# Altium project ИТКС.685623.177.PrjPcb
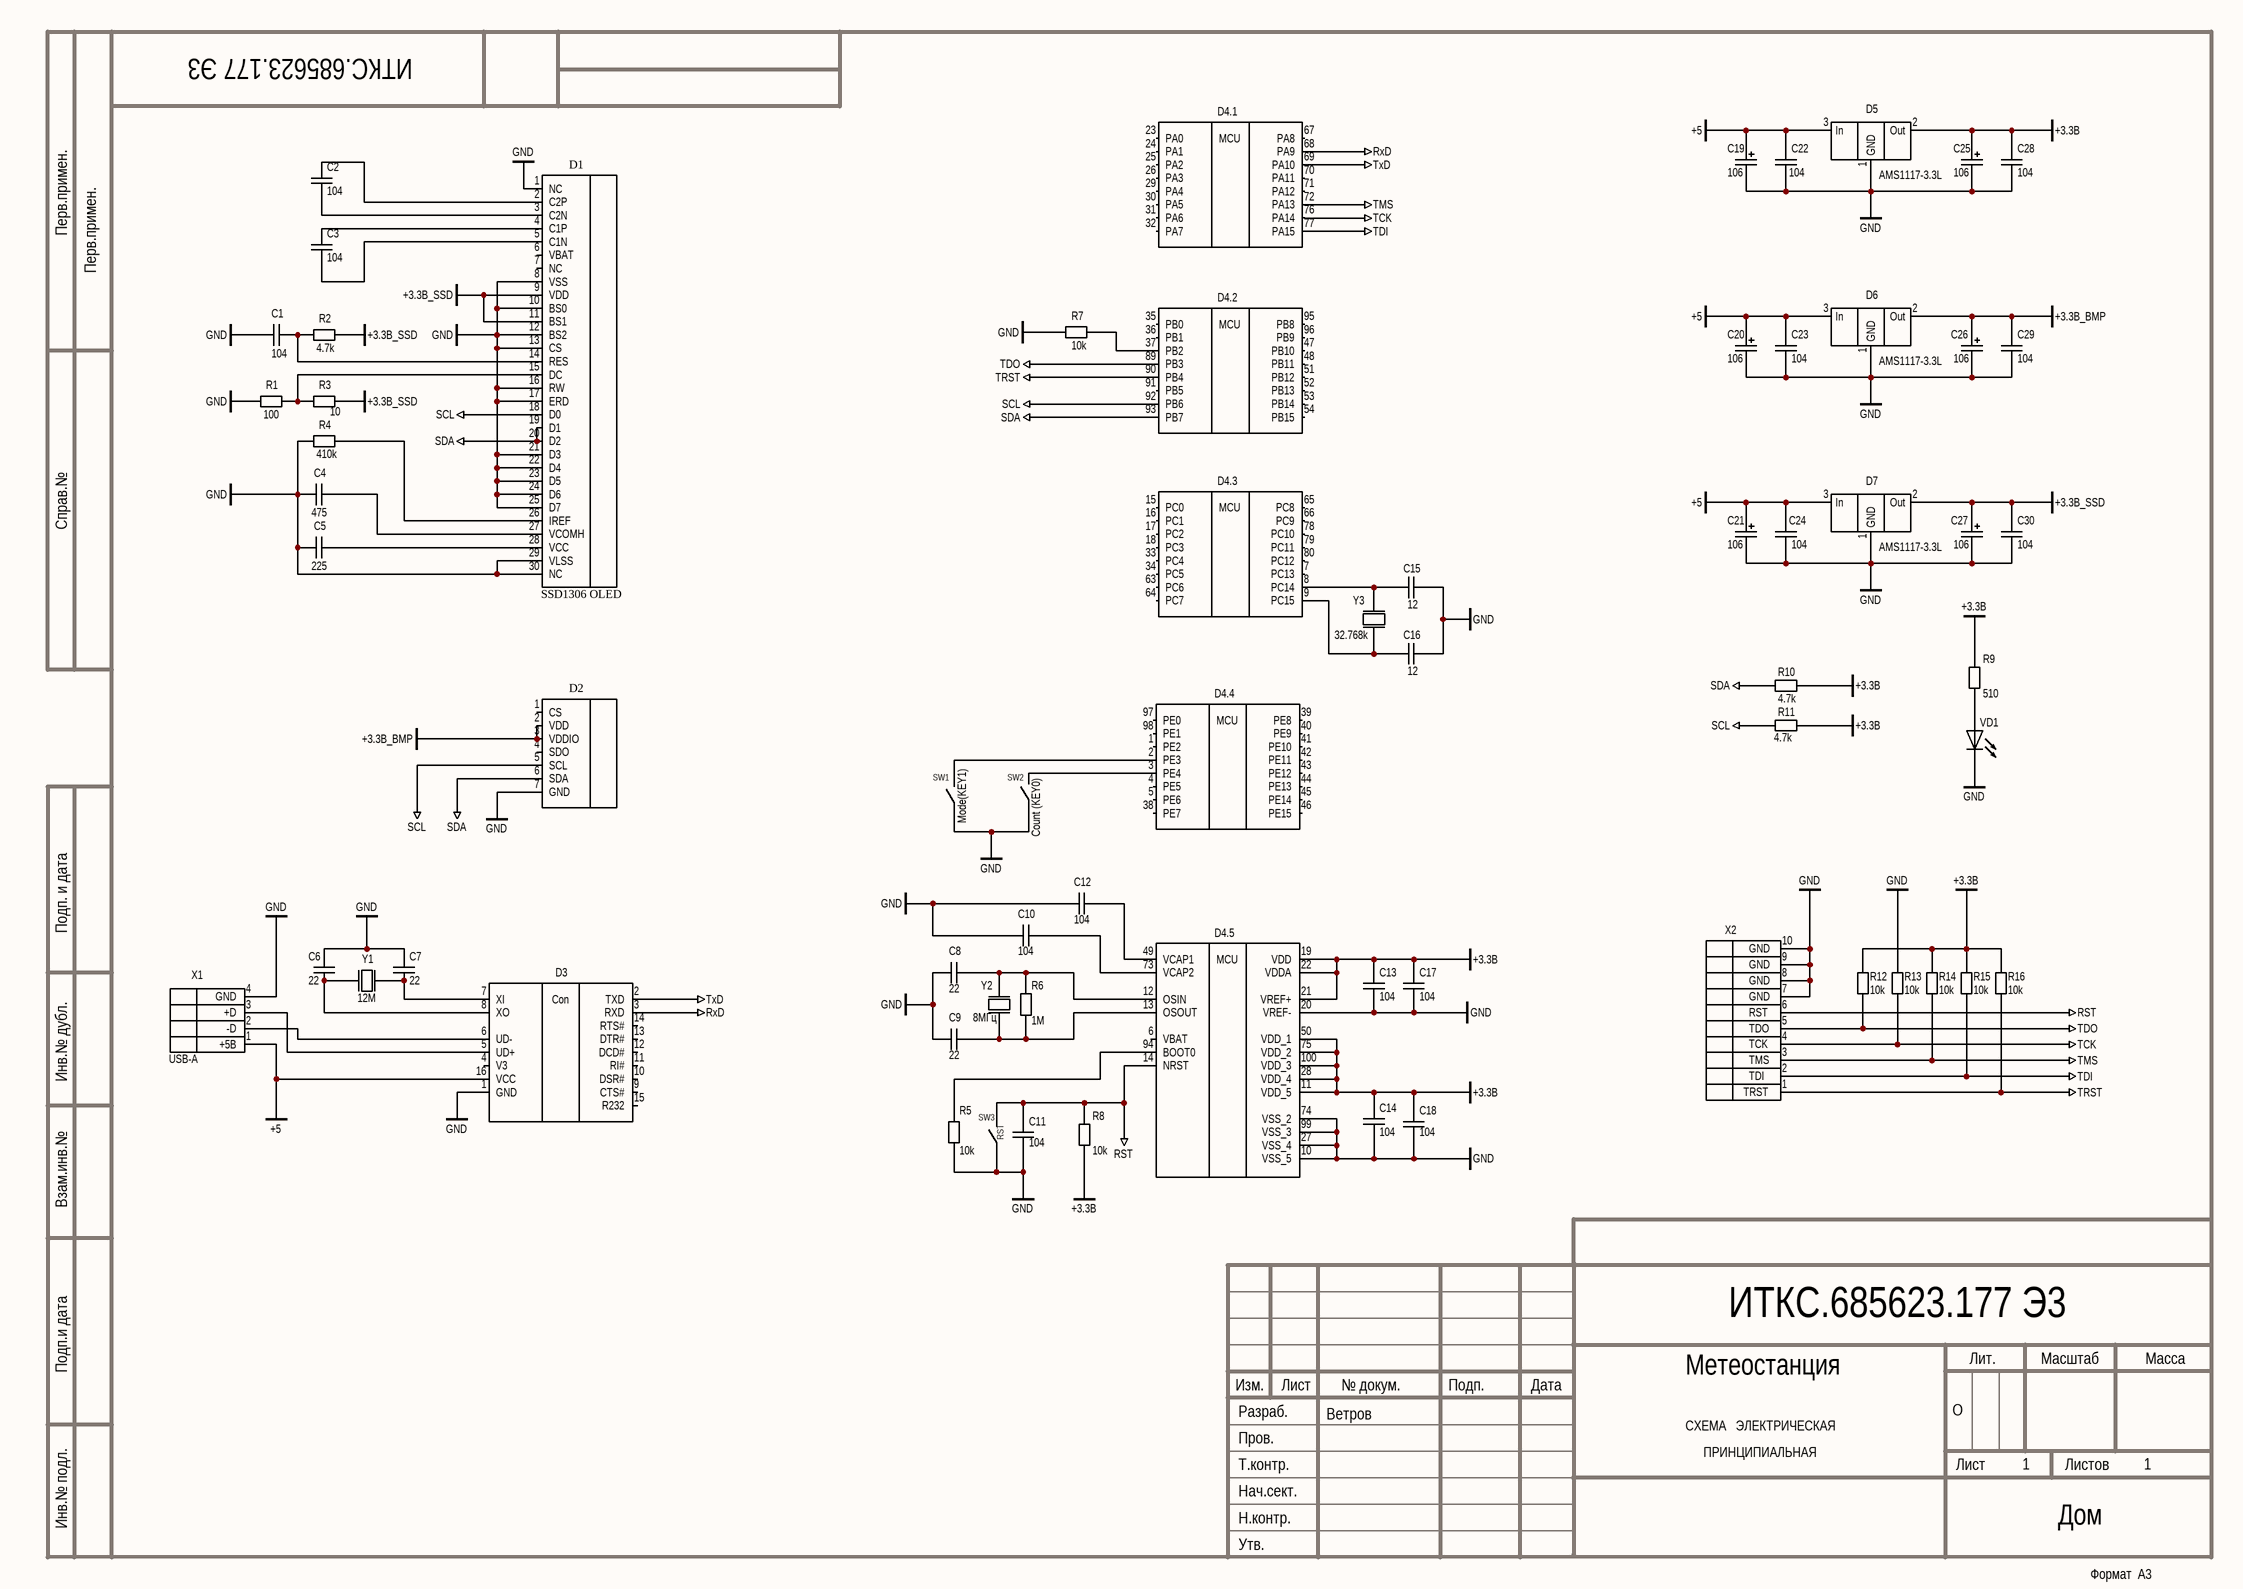
[diagram p0: ИТКС.685623.177 Э3.SchDoc]
1 sheet, 62 parts. Net scope: global (net labels, ports and power ports of the same name join across sheets).
Board file: ИТКС.177623.PcbDoc

## Sheet ИТКС.685623.177 Э3.SchDoc
size 420 x 297 mm; Author: Ветров; CompanyName: Дом; SheetNumber: 1; SheetTotal: 1; PageSetup: Record=PageOptions|CenterHorizontal=True|CenterVertical=True|PrintScale=0.94|XCorrection=1.00|YCorrection=1.00|PrintKind=1|BorderSize=5000000|LeftOffset=0|BottomOffset=0|Orientation=1|PaperLength=1000|PaperWidth=1000|Scale=100|PaperSource=7|PrintQuality=-4|MediaType=1|DitherType=10|PaperKind=A4|PrintScaleMode=1; DecimalNumber: ИТКС.685623.177 Э3; MainDevice: Перв.примен.; Name1: Метеостанция; lit_A: О; Name: Наименование

### Parts
C1  104  [0603]
C2  104  [0603]
C3  104  [0603]
C4  475  [0603]
C5  225  [0603]
C6  22  [0603]
C7  22  [0603]
C8  22  [0603]
C9  22  [0603]
C10  104  [0603]
C11  104  [0603]
C12  104  [0603]
C13  104  [0603]
C14  104  [0603]
C15  12  [0603]
C16  12  [0603]
C17  104  [0603]
C18  104  [0603]
C19  106  [EIA_6032–28]
C20  106  [EIA_6032–28]
C21  106  [EIA_6032–28]
C22  104  [0603]
C23  104  [0603]
C24  104  [0603]
C25  106  [EIA_6032–28]
C26  106  [EIA_6032–28]
C27  106  [EIA_6032–28]
C28  104  [0603]
C29  104  [0603]
C30  104  [0603]
D1  SSD1306 OLED  [SSD1306]
D2  BMP180  [BMP180]  (value not drawn)
D3  CH340G  [SOP16]  (value not drawn)
D4  STM32F407VE  [LQFP100]  (value not drawn)  (parts A,B,C,E,F of 6)
D5  AMS1117-3.3L  [SOT223-4N]
D6  AMS1117-3.3L  [SOT223-4N]
D7  AMS1117-3.3L  [SOT223-4N]
R1  100  [0603]
R2  4.7k  [0603]
R3  10  [0603]
R4  410k  [0603]
R5  10k  [0603]
R6  1M  [0603]
R7  10k  [0603]
R8  10k  [0603]
R9  510  [0603]
R10  4.7k  [0603]
R11  4.7k  [0603]
R12  10k  [0603]
R13  10k  [0603]
R14  10k  [0603]
R15  10k  [0603]
R16  10k  [0603]
SW1  Mode(KEY1)  [0603]
SW2  Count (KEY0)  [0603]
SW3  RST  [0603]
VD1  LED SMD 0805  [Led Diode 0805]  (value not drawn)
X1  USB-A  [USB-ASM (DS1098-B)]
X2  PLC-10  [PLC-10]  (value not drawn)
Y1  12M  [HC-49SM]
Y2  8МГц  [HC-49SM]
Y3  32.768k  [HC-49SM]

### Nets
+3.3В: C13.1 C14.1 C17.1 C18.1 C25.1 C28.2 D4.11(VDD_5) D4.19(VDD) D4.21(VREF+) D4.22(VDDA) D4.28(VDD_4) D4.50(VDD_1) D4.75(VDD_2) D4.100(VDD_3) D5.2(Out) R8.2 R9.1 R10.2 R11.2 R12.2 R14.2 R15.2 R16.2
+3.3В_BMP: C26.1 C29.2 D2.2(VDD) D2.3(VDDIO) D6.2(Out)
+3.3В_SSD: C27.1 C30.2 D1.9(VDD) D1.11(BS1) D7.2(Out) R2.1 R3.1
+5: C19.1 C20.1 C21.1 C22.2 C23.2 C24.2 D3.16(VCC) D5.3(In) D6.3(In) D7.3(In) X1.1(+5В)
GND: C1.1 C4.1 C5.1 C6.2 C7.2 C8.2 C9.2 C10.2 C11.1 C12.2 C13.2 C14.2 C15.1 C16.1 C17.2 C18.2 C19.2 C20.2 C21.2 C22.1 C23.1 C24.1 C25.2 C26.2 C27.2 C28.1 C29.1 C30.1 D1.1(NC) D1.8(VSS) D1.10(BS0) D1.12(BS2) D1.13(CS) D1.16(RW) D1.17(ERD) D1.21(D3) D1.22(D4) D1.23(D5) D1.24(D6) D1.25(D7) D1.29(VLSS) D1.30(NC) D2.7(GND) D3.1(GND) D4.10(VSS_5) D4.20(VREF-) D4.27(VSS_4) D4.74(VSS_2) D4.99(VSS_3) D5.1(GND) D6.1(GND) D7.1(GND) R1.2 R4.2 R5.2 R7.1 R13.2 SW1.1 SW2.1 SW3.1 VD1.K X1.4(GND) X2.7 X2.8 X2.9 X2.10
RST: C11.2 D4.14(NRST) R8.1 SW3.2 X2.6
RxD: D3.3(RXD) D4.68(PA9)
SCL: D1.18(D0) D2.5(SCL) D4.92(PB6) R11.1
SDA: D1.19(D1) D1.20(D2) D2.6(SDA) D4.93(PB7) R10.1
TCK: D4.76(PA14) R13.1 X2.4
TDI: D4.77(PA15) R15.1 X2.2
TDO: D4.89(PB3) R12.1 X2.5
TMS: D4.72(PA13) R14.1 X2.3
TRST: D4.90(PB4) R16.1 X2.1
TxD: D3.2(TXD) D4.69(PA10)
NetC1_2: C1.2 D1.14(RES) R2.2
NetC2_1: C2.1 D1.2(C2P)
NetC2_2: C2.2 D1.3(C2N)
NetC3_1: C3.1 D1.4(C1P)
NetC3_2: C3.2 D1.5(C1N)
NetC4_2: C4.2 D1.27(VCOMH)
NetC5_2: C5.2 D1.28(VCC)
NetC6_1: C6.1 D3.8(XO) Y1.2
NetC7_1: C7.1 D3.7(XI) Y1.1
NetC8_1: C8.1 D4.12(OSIN) R6.2 Y2.2
NetC9_1: C9.1 D4.13(OSOUT) R6.1 Y2.1
NetC10_1: C10.1 D4.73(VCAP2)
NetC12_1: C12.1 D4.49(VCAP1)
NetC15_2: C15.2 D4.8(PC14) Y3.2
NetC16_2: C16.2 D4.9(PC15) Y3.1
NetD1_15: D1.15(DC) R1.1 R3.2
NetD1_26: D1.26(IREF) R4.1
NetD3_5: D3.5(UD+) X1.3(+D)
NetD3_6: D3.6(UD-) X1.2(-D)
NetD4_2: D4.2(PE3) SW1.2
NetD4_3: D4.3(PE4) SW2.2
NetD4_37: D4.37(PB2) R7.2
NetD4_94: D4.94(BOOT0) R5.1
NetR9_2: R9.2 VD1.A

Not connected (* = marked no-connect by the designer): D1 6(VBAT) 7(NC); D2 1(CS) 4(SDO); D3 4(V3) 9(CTS#) 10(DSR#) 11(RI#) 12(DCD#) 13(DTR#) 14(RTS#) 15(R232); D4 1(PE2) 4(PE5) 5(PE6) 6(VBAT) 7(PC13) 15(PC0) 16(PC1) 17(PC2) 18(PC3) 23(PA0) 24(PA1) 25(PA2) 26(PA3) 29(PA4) 30(PA5) 31(PA6) 32(PA7) 33(PC4) 34(PC5) 35(PB0) 36(PB1) 38(PE7) 39(PE8) 40(PE9) 41(PE10) 42(PE11) 43(PE12) 44(PE13) 45(PE14) 46(PE15) 47(PB10) 48(PB11) 51(PB12) 52(PB13) 53(PB14) 54(PB15) 63(PC6) 64(PC7) 65(PC8) 66(PC9) 67(PA8) 70(PA11) 71(PA12) 78(PC10) 79(PC11) 80(PC12) 91(PB5) 95(PB8) 96(PB9) 97(PE0) 98(PE1)

### Notes on the sheet
- (near D4) D4.1
- (near D4) D4.2
- (near D4) D4.3
- (near D4) D4.4
- (near D4) D4.5
- (near X2) GND
- (near X2) TMS
- (near X2) TCK
- (near X2) TDO
- (near X2) RST
- (near X2) TRST
- (near X2) TDI
- Перв.примен.
- Справ.№
- Подп. и дата
- Инв.№ дубл.
- Взам.инв.№
- Подп.и дата
- Разраб.
- Изм.
- Лист
- № докум.
- Подп.
- Дата
- Лит.
- Масштаб
- Масса
- Т.контр.
- Пров.
- СХЕМА   ЭЛЕКТРИЧЕСКАЯ
- ПРИНЦИПИАЛЬНАЯ
- Листов
- Инв.№ подл.
- Утв.
- Н.контр.
- Нач.сект.
- Формат  A3
- (in symbol CH340G) Con
- (in symbol STM32F407VE, part A) MCU
- (in symbol STM32F407VE, part B) MCU
- (in symbol STM32F407VE, part C) MCU
- (in symbol STM32F407VE, part E) MCU
- (in symbol STM32F407VE, part F) MCU

### Library data of the parts
C1-C18 C22-C24 C28-C30 = C
C19-C21 C25-C27 = C+ TECAP: TECAP EIA 6032–28
D4 = STM32F407VE: ARM3
R1-R16 = R
SW1-SW3 = Button
Y1-Y3 = BQ